# Altium schematic sheet SH1 - 48V POWER.SchDoc: =documentname
size B; Organization: UW Robotics; Address1: 200 University Avenue; Address2: Waterloo; Address3: Ontario; Address4: Canada N2L 3G6; DocumentNumber: 1; SheetNumber: 1
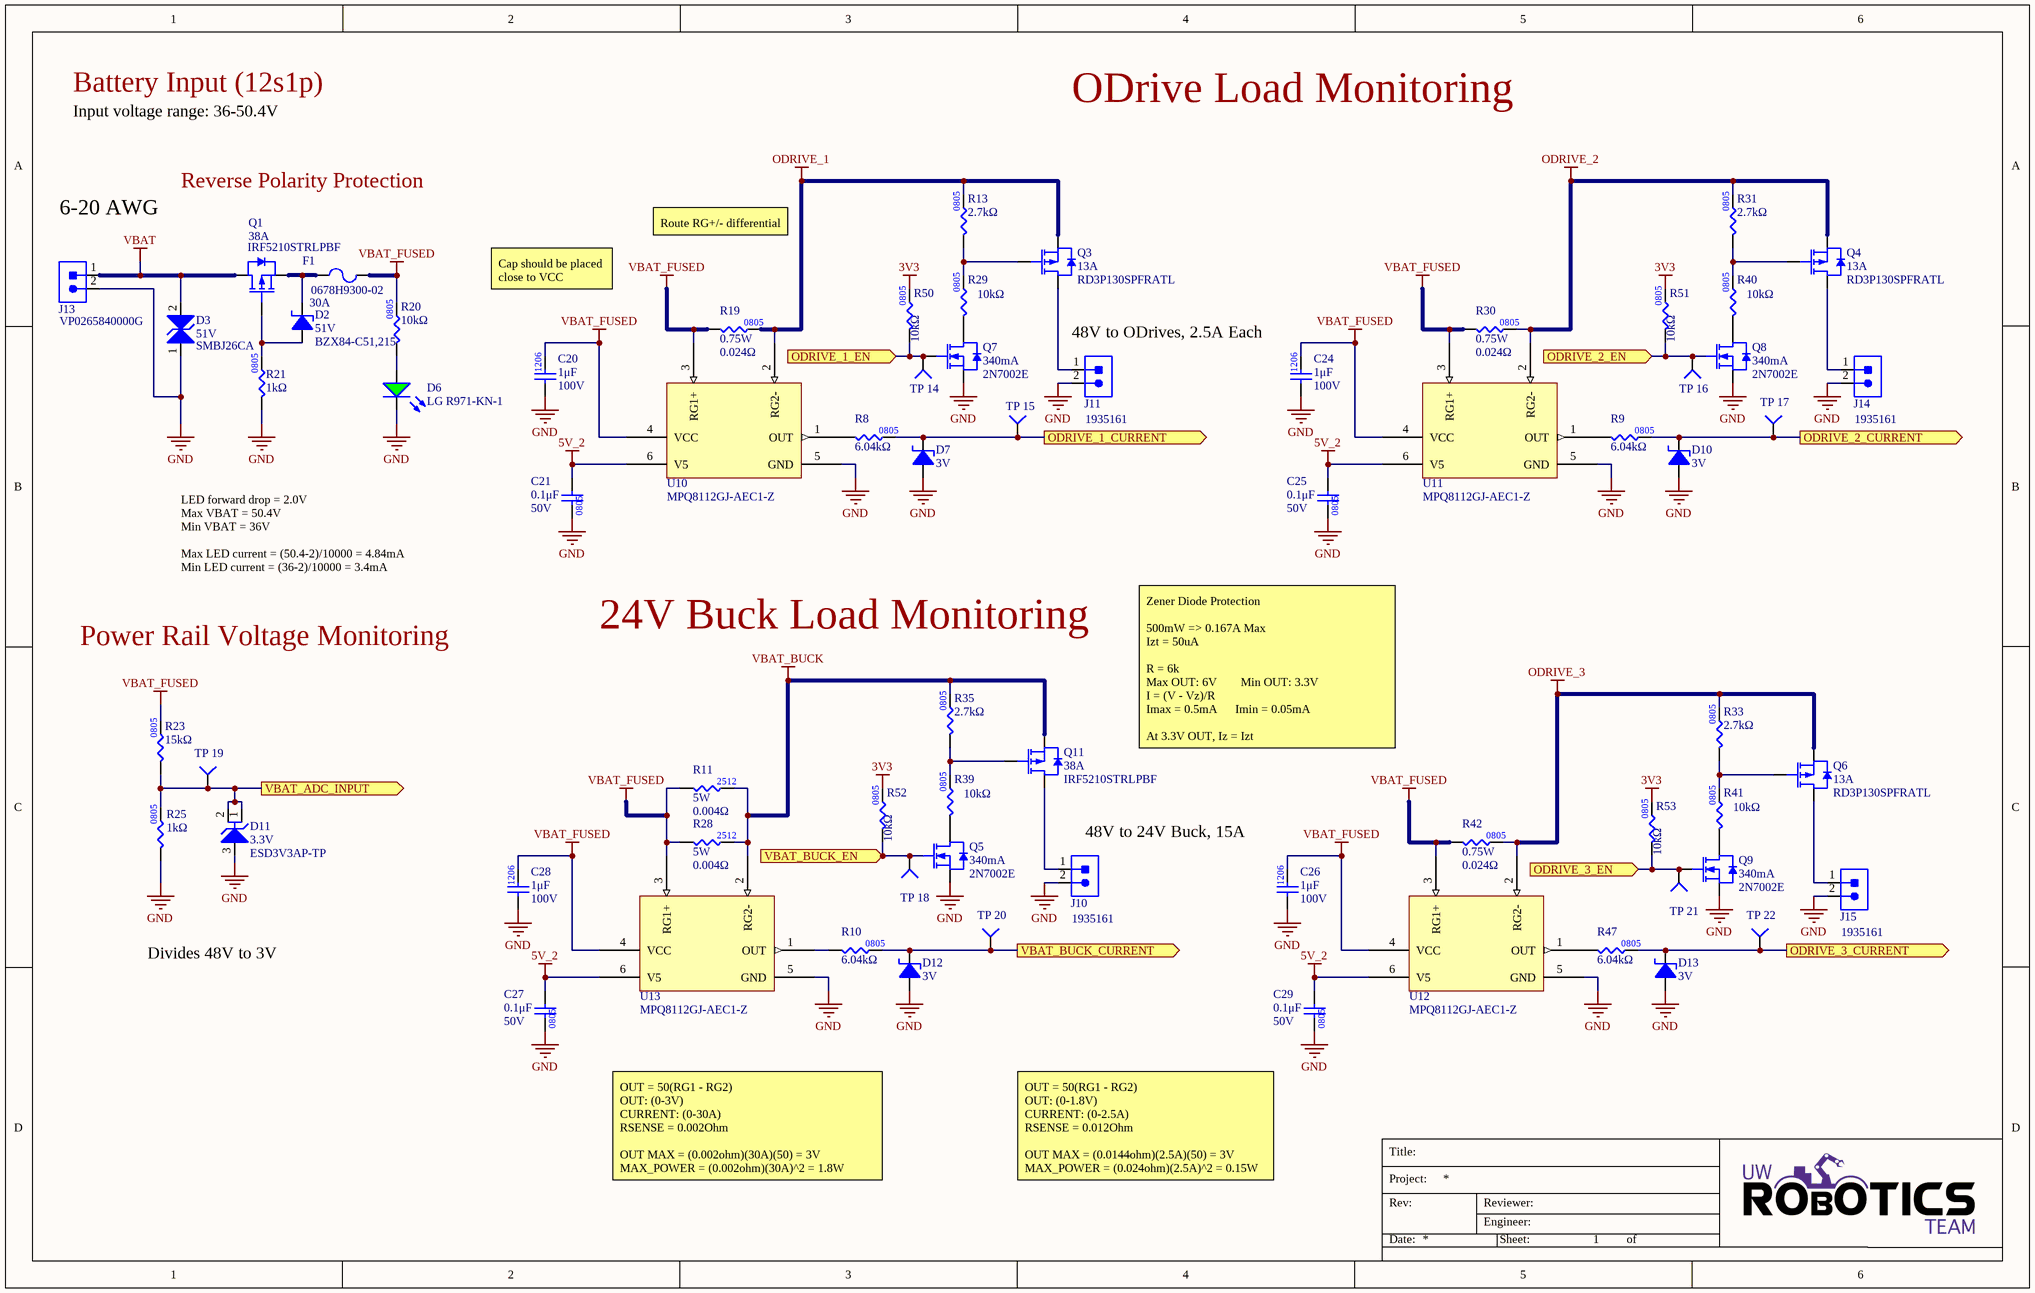
[diagram p0: SH1 - 48V POWER.SchDoc]

## Parts
C20  value 1μF  Voltage Rating: 100V  [CAPC3216X190X50NL20T25]  (hidden comment: CAP_1uF_100V_1206)
C21  value 0.1μF  Voltage Rating: 50V  [CAP2012]  (hidden comment: CAP_0.1uF_50V_0805)
C24  value 1μF  Voltage Rating: 100V  [CAPC3216X190X50NL20T25]  (hidden comment: CAP_1uF_100V_1206)
C25  value 0.1μF  Voltage Rating: 50V  [CAP2012]  (hidden comment: CAP_0.1uF_50V_0805)
C26  value 1μF  Voltage Rating: 100V  [CAPC3216X190X50NL20T25]  (hidden comment: CAP_1uF_100V_1206)
C27  value 0.1μF  Voltage Rating: 50V  [CAP2012]  (hidden comment: CAP_0.1uF_50V_0805)
C28  value 1μF  Voltage Rating: 100V  [CAPC3216X190X50NL20T25]  (hidden comment: CAP_1uF_100V_1206)
C29  value 0.1μF  Voltage Rating: 50V  [CAP2012]  (hidden comment: CAP_0.1uF_50V_0805)
D2  Manufacturer Part Number 1: BZX84-C51,215  Working Voltage: 51V  [SOT23-3]  (hidden comment: DIO_ZENER_51V)
D3  Manufacturer Part Number 1: SMBJ26CA  Voltage - Reverse Standoff (Typ): 51V  [TVS_DIODE_BIDIR_SMB]  (hidden comment: TVS_DIODE_BIDIR_51V)
D6  Manufacturer Part Number 1: LG R971-KN-1  [LED_0805_GREEN]  (hidden comment: LED_GREEN)
D7  Working Voltage: 3V  [MMSZ4683-TP]  (hidden comment: DIO_ZENER_3V)
D10  Working Voltage: 3V  [MMSZ4683-TP]  (hidden comment: DIO_ZENER_3V)
D11  Voltage - Reverse Standoff (Typ): 3.3V  [ESD3V3AP-TP]  (hidden comment: TVS_DIODE_3.3V_13.3A)
D12  Working Voltage: 3V  [MMSZ4683-TP]  (hidden comment: DIO_ZENER_3V)
D13  Working Voltage: 3V  [MMSZ4683-TP]  (hidden comment: DIO_ZENER_3V)
F1  Manufacturer Part Number 1: 0678H9300-02  Current Rating: 30A  [FUSE_3912]  (hidden comment: FUSE_30A_3912)
J10  CON_2M_TERM  [1935161]  (value not drawn)
J11  CON_2M_TERM  [1935161]  (value not drawn)
J13  CON_2POS_SCREW_TERM  [VP0265840000G]  (value not drawn)
J14  CON_2M_TERM  [1935161]  (value not drawn)
J15  CON_2M_TERM  [1935161]  (value not drawn)
Q1  Current - Continous Drain: 38A  Manufacturer Part Number 1: IRF5210STRLPBF  [DPAK254P1524X483-4_3N - new]  (hidden comment: PMOS_100V_38A)
Q3  Current - Continous Drain: 13A  [RD3P130SPFRATL]  (hidden comment: PMOS_100V_13A)
Q4  Current - Continous Drain: 13A  [RD3P130SPFRATL]  (hidden comment: PMOS_100V_13A)
Q5  Id: 340mA  Manufacturer Part Number 1: 2N7002E  [SOT23-3]  (hidden comment: NMOS_60V_340mS)
Q6  Current - Continous Drain: 13A  [RD3P130SPFRATL]  (hidden comment: PMOS_100V_13A)
Q7  Id: 340mA  Manufacturer Part Number 1: 2N7002E  [SOT23-3]  (hidden comment: NMOS_60V_340mS)
Q8  Id: 340mA  Manufacturer Part Number 1: 2N7002E  [SOT23-3]  (hidden comment: NMOS_60V_340mS)
Q9  Id: 340mA  Manufacturer Part Number 1: 2N7002E  [SOT23-3]  (hidden comment: NMOS_60V_340mS)
Q11  Current - Continous Drain: 38A  Manufacturer Part Number 1: IRF5210STRLPBF  [DPAK254P1524X483-4_3N - new]  (hidden comment: PMOS_100V_38A)
R8  value 6.04kΩ  [RES0805]  (hidden comment: RES_6.04kΩ_0805_1%)
R9  value 6.04kΩ  [RES0805]  (hidden comment: RES_6.04kΩ_0805_1%)
R10  value 6.04kΩ  [RES0805]  (hidden comment: RES_6.04kΩ_0805_1%)
R11  value 0.004Ω  Power: 5W  [RESC6532X75N]  (hidden comment: RES_4mΩ_2512_1%_5W)
R13  value 2.7kΩ  [RES0805]  (hidden comment: RES_2.7kΩ_0805_1%)
R19  value 0.024Ω  Power: 0.75W  [RES0805]  (hidden comment: RES_24mΩ_0805_1%)
R20  value 10kΩ  [RES0805]  (hidden comment: RES_10kΩ_0805_5%)
R21  value 1kΩ  [RES0805]  (hidden comment: RES_1kΩ_0805_1%)
R23  value 15kΩ  [RES0805]  (hidden comment: RES_15kΩ_0805_1%)
R25  value 1kΩ  [RES0805]  (hidden comment: RES_1kΩ_0805_1%_1)
R28  value 0.004Ω  Power: 5W  [RESC6532X75N]  (hidden comment: RES_4mΩ_2512_1%_5W)
R29  value 10kΩ  [RES0805]  (hidden comment: RES_10kΩ_0805_5%)
R30  value 0.024Ω  Power: 0.75W  [RES0805]  (hidden comment: RES_24mΩ_0805_1%)
R31  value 2.7kΩ  [RES0805]  (hidden comment: RES_2.7kΩ_0805_1%)
R33  value 2.7kΩ  [RES0805]  (hidden comment: RES_2.7kΩ_0805_1%)
R35  value 2.7kΩ  [RES0805]  (hidden comment: RES_2.7kΩ_0805_1%)
R39  value 10kΩ  [RES0805]  (hidden comment: RES_10kΩ_0805_5%)
R40  value 10kΩ  [RES0805]  (hidden comment: RES_10kΩ_0805_5%)
R41  value 10kΩ  [RES0805]  (hidden comment: RES_10kΩ_0805_5%)
R42  value 0.024Ω  Power: 0.75W  [RES0805]  (hidden comment: RES_24mΩ_0805_1%)
R47  value 6.04kΩ  [RES0805]  (hidden comment: RES_6.04kΩ_0805_1%)
R50  value 10kΩ  [RES0805]  (hidden comment: RES_10kΩ_0805_5%)
R51  value 10kΩ  [RES0805]  (hidden comment: RES_10kΩ_0805_5%)
R52  value 10kΩ  [RES0805]  (hidden comment: RES_10kΩ_0805_5%)
R53  value 10kΩ  [RES0805]  (hidden comment: RES_10kΩ_0805_5%)
TP_14  TESTPOINT_1MM_CIRCLE  [TESTPOINT_CIRCLE_1MM]  (value not drawn)  (no BOM)
TP_15  TESTPOINT_1MM_CIRCLE  [TESTPOINT_CIRCLE_1MM]  (value not drawn)  (no BOM)
TP_16  TESTPOINT_1MM_CIRCLE  [TESTPOINT_CIRCLE_1MM]  (value not drawn)  (no BOM)
TP_17  TESTPOINT_1MM_CIRCLE  [TESTPOINT_CIRCLE_1MM]  (value not drawn)  (no BOM)
TP_18  TESTPOINT_1MM_CIRCLE  [TESTPOINT_CIRCLE_1MM]  (value not drawn)  (no BOM)
TP_19  TESTPOINT_1MM_CIRCLE  [TESTPOINT_CIRCLE_1MM]  (value not drawn)  (no BOM)
TP_20  TESTPOINT_1MM_CIRCLE  [TESTPOINT_CIRCLE_1MM]  (value not drawn)  (no BOM)
TP_21  TESTPOINT_1MM_CIRCLE  [TESTPOINT_CIRCLE_1MM]  (value not drawn)  (no BOM)
TP_22  TESTPOINT_1MM_CIRCLE  [TESTPOINT_CIRCLE_1MM]  (value not drawn)  (no BOM)
U10  MPQ8112GJ-AEC1-Z  [MPQ8112GJ-AEC1-Z]
U11  MPQ8112GJ-AEC1-Z  [MPQ8112GJ-AEC1-Z]
U12  MPQ8112GJ-AEC1-Z  [MPQ8112GJ-AEC1-Z]
U13  MPQ8112GJ-AEC1-Z  [MPQ8112GJ-AEC1-Z]

## Ports
ODRIVE_1_CURRENT (out), ODRIVE_1_EN (in), ODRIVE_2_CURRENT (out), ODRIVE_2_EN (in), ODRIVE_3_CURRENT (out), ODRIVE_3_EN (in), VBAT_ADC_INPUT (out), VBAT_BUCK_CURRENT (out), VBAT_BUCK_EN (in)

## Nets
3V3: R50.2 R51.2 R52.2 R53.2
5V_2: C21.2 C25.2 C27.2 C29.2 U10.6(V5) U11.6(V5) U12.6(V5) U13.6(V5)
GND: C20.1 C21.1 C24.1 C25.1 C26.1 C27.1 C28.1 C29.1 D3.1 D6.2(K) D7.1(Anode) D10.1(Anode) D11.3 D12.1(Anode) D13.1(Anode) J10.2 J11.2 J13.2 J14.2 J15.2 Q5.2(Source) Q7.2(Source) Q8.2(Source) Q9.2(Source) R21.1 R25.1 U10.5(GND) U11.5(GND) U12.5(GND) U13.5(GND)
ODRIVE_1: Q3.3(Source) R13.2 R19.2 U10.2(RG2-)
ODRIVE_2: Q4.3(Source) R30.2 R31.2 U11.2(RG2-)
ODRIVE_3: Q6.3(Source) R33.2 R42.2 U12.2(RG2-)
VBAT: D3.2 J13.1 Q1.2(Drain)
VBAT_BUCK: Q11.3(Source) R11.2 R28.2 R35.2 U13.2(RG2-)
VBAT_FUSED: C20.2 C24.2 C26.2 C28.2 F1.2 R11.1 R19.1 R20.2 R23.2 R28.1 R30.1 R42.1 U10.3(RG1+) U10.4(VCC) U11.3(RG1+) U11.4(VCC) U12.3(RG1+) U12.4(VCC) U13.3(RG1+) U13.4(VCC)
ODRIVE_1_CURRENT: D7.2(Cathode) R8.2 TP_15.1(=value) ; port ODRIVE_1_CURRENT
ODRIVE_1_EN: Q7.1(Gate) R50.1 TP_14.1(=value) ; port ODRIVE_1_EN
ODRIVE_2_CURRENT: D10.2(Cathode) R9.2 TP_17.1(=value) ; port ODRIVE_2_CURRENT
ODRIVE_2_EN: Q8.1(Gate) R51.1 TP_16.1(=value) ; port ODRIVE_2_EN
ODRIVE_3_CURRENT: D13.2(Cathode) R47.2 TP_22.1(=value) ; port ODRIVE_3_CURRENT
ODRIVE_3_EN: Q9.1(Gate) R53.1 TP_21.1(=value) ; port ODRIVE_3_EN
VBAT_ADC_INPUT: D11.1 D11.2 R23.1 R25.2 TP_19.1(=value) ; port VBAT_ADC_INPUT
VBAT_BUCK_CURRENT: D12.2(Cathode) R10.2 TP_20.1(=value) ; port VBAT_BUCK_CURRENT
VBAT_BUCK_EN: Q5.1(Gate) R52.1 TP_18.1(=value) ; port VBAT_BUCK_EN
NetD2_1: D2.1(Anode) Q1.1(Gate) R21.2
NetD2_3: D2.3(Cathode) F1.1 Q1.3(Source)
NetD6_1: D6.1(A) R20.1
NetJ10_1: J10.1 Q11.2(Drain)
NetJ11_1: J11.1 Q3.2(Drain)
NetJ14_1: J14.1 Q4.2(Drain)
NetJ15_1: J15.1 Q6.2(Drain)
NetQ3_1: Q3.1(Gate) R13.1 R29.2
NetQ4_1: Q4.1(Gate) R31.1 R40.2
NetQ5_3: Q5.3(Drain) R39.1
NetQ6_1: Q6.1(Gate) R33.1 R41.2
NetQ7_3: Q7.3(Drain) R29.1
NetQ8_3: Q8.3(Drain) R40.1
NetQ9_3: Q9.3(Drain) R41.1
NetQ11_1: Q11.1(Gate) R35.1 R39.2
NetR8_1: R8.1 U10.1(OUT)
NetR9_1: R9.1 U11.1(OUT)
NetR10_1: R10.1 U13.1(OUT)
NetR47_1: R47.1 U12.1(OUT)

## Notes on the sheet
- Battery Input (12s1p)
- Input voltage range: 36-50.4V
- ODrive Load Monitoring
- 6-20 AWG
- Reverse Polarity Protection
- Route RG+/- differential
- Cap should be placed close to VCC
- 48V to ODrives, 2.5A Each
- LED forward drop = 2.0V
  Max VBAT = 50.4V
  Min VBAT = 36V
  Max LED current = (50.4-2)/10000 = 4.84mA
  Min LED current = (36-2)/10000 = 3.4mA
- 24V Buck Load Monitoring
- Power Rail Voltage Monitoring
- Zener Diode Protection
  500mW => 0.167A Max
  Izt = 50uA
  R = 6k
  Max OUT: 6V        Min OUT: 3.3V
  I = (V - Vz)/R
  Imax = 0.5mA      Imin = 0.05mA
  At 3.3V OUT, Iz = Izt
- 48V to 24V Buck, 15A
- Divides 48V to 3V
- OUT = 50(RG1 - RG2)
  OUT: (0-3V)
  CURRENT: (0-30A)
  RSENSE = 0.002Ohm
  OUT MAX = (0.002ohm)(30A)(50) = 3V
  MAX_POWER = (0.002ohm)(30A)^2 = 1.8W
- OUT = 50(RG1 - RG2)
  OUT: (0-1.8V)
  CURRENT: (0-2.5A)
  RSENSE = 0.012Ohm
  OUT MAX = (0.0144ohm)(2.5A)(50) = 3V
  MAX_POWER = (0.024ohm)(2.5A)^2 = 0.15W
- Title:
- Project:
- Date:
- Rev:
- Reviewer:
- Engineer:
- Sheet:
- of
- (in symbol RES_4mΩ_2512_1%_5W) 2512
- (in symbol RES_15kΩ_0805_1%) 0805

## Library data of the parts
C20 C24 C26 C28 = CAP_1uF_100V_1206: CAP CER 1UF 100V X7R 1206; Supplier 1: Digi-Key; Mounting Type: SMD; Package: 1206; Supplier Part Number 1: 490-16468-1-ND
C21 C25 C27 C29 = CAP_0.1uF_50V_0805: CAP CER 0.1UF 50V X7R 0805; Manufacturer Part Number 1: GCM21BR71H104KA37K; Manufacturer 1: Murata Electronics; Package/Footprint: 0805; Supplier Part Number 1: 490-8049-1-ND; Supplier 1: Digi-Key; Dielectric: X7R; LCSC Part #: C49678; Mounting Type: SMD
D2 = DIO_ZENER_51V: DIODE ZENER 51V 250MW TO236AB; Manufacturer 1: Nexperia USA Inc.; Forward Voltage: 0.9V; Supplier Part Number 1: 1727-5037-1-ND; Supplier 1: Digi-Key; Package/Case: SOT-23-3
D3 = TVS_DIODE_BIDIR_51V: TVS DIODE 51VWM 82.4VC DO214AA; Manufacturer 1: Littelfuse; Package/Footprint: SMB; Voltage - Clamping (Max) @ Ipp: 82.4V; Voltage - Breakdown (Min): 56.7V; Mounting Type: SMD; Supplier 1: Digi-Key; Supplier Part Number 1: SMBJ51CALFCT-ND; Supplier 2: Digi-Key; Supplier Part Number 2: SMBJ51CA-FDIDKR-ND
D6 = LED_GREEN: LED GREEN DIFFUSED 0805 SMD; Manufacturer 1: OSRAM; Forward Voltage Drop: 2.2V; Package/Footprint: 0805; Mounting Type: SMD; Supplier 1: Digi-Key; Supplier Part Number 1: 475-1410-1-ND; Supplier 2: Future Electronics; Supplier Part Number 2: 1152237
D7 D10 D12 D13 = DIO_ZENER_3V: DIODE ZENER 3V 500MW SOD123; Manufacturer 1: Micro Commercial Co; Forward Voltage: 0.95V; Manufacturer Part Number 1: MMSZ4683-TP; Supplier Part Number 1: MMSZ4683-TPMSCT-ND; Supplier 1: Digi-Key; Package/Case: SOD-123
D11 = TVS_DIODE_3.3V_13.3A: TVS DIODE 3.3VWM 7.5VC SOT23; Manufacturer 1: Micro Commercial Co; Package/Footprint: SOT-23; Voltage - Breakdown (Min): 5V; Voltage - Clamping (Max) @ Ipp: 7.5V; Mounting Type: SMD; Supplier 1: Digi-Key; Supplier Part Number 1: ESD3V3AP-TPMSCT-ND; Manufacturer Part Number 1: ESD3V3AP-TP
F1 = FUSE_30A_3912: FUSE SMT 3912 ENH BRK 250V 30A; Manufacturer 1: Bel Fuse Inc.; Package/Footprint: 3912; Supplier 1: Digi-Key; Supplier Part Number 1: 507-2254-1-ND; Mounting Type: SMD; Verified: No
J10 J11 J14 J15 = CON_2M_TERM: TERM BLK 2POS SIDE ENTRY 5MM; Manufacturer 1: Phoenix Contact; Max Current Rating: 16A; Current: 18A; Voltage: 300V; Package/Footprint: SMD; Supplier 1: Digi-Key; Supplier Part Number 1: 277-1667-ND; Manufacturer Part Number 1: 1935161; Mounting Type: TH
J13 = CON_2POS_SCREW_TERM_65A: PCB TERMINAL BLOCKS RISING CLAMP; Manufacturer 1: Amphenol Anytek; Supplier 1: Digi-Key; Mounting Type: TH; Package/Footprint: TERMINAL; Supplier Part Number 1: 1818-VP0265840000G-ND; Manufacturer Part Number 1: VP0265840000G
Q1 Q11 = PMOS_100V_38A: MOSFET P-CH 100V 38A D2PAK; Manufacturer 1: Vishay Siliconix; Vgs (Max): ±15V; Id: 120A; Mounting Type: SMD; Verified: No; Vdss: 100V; Supplier 1: Digi-Key; Supplier Part Number 1: IRF5210STRLPBFCT-ND; Package/Footprint: D2Pak
Q3 Q4 Q6 = PMOS_100V_13A: MOSFET P-CH 100V 13A TO252; Manufacturer 1: Rohm Semiconductor; Vgs (Max): ±20V; Package/Footprint: D2Pak; Mounting Type: SMD; Verified: No; Vdss: 100V; Supplier 1: Digi-Key; Supplier Part Number 1: RD3P130SPFRATLCT-ND; Manufacturer Part Number 1: RD3P130SPFRATL
Q5 Q7-Q9 = NMOS_60V_340mS: N-Channel 60 V 340mA (Ta) 350mW (Ta) Surface Mount SOT-23; Manufacturer 1: ANBON SEMICONDUCTOR (INT'L) LIMITED; Vgs (Max): ±20V; Vdss: 60V; Supplier 1: Digi-Key; Supplier Part Number 1: 4530-2N7002ECT-ND; Mounting Type: SMD; Package/Footprint: SOT-23; Verified: No
R8-R10 R47 = RES_6.04kΩ_0805_1%: RES 6.04K OHM 1% 1/8W 0805; Manufacturer 1: Yageo; Manufacturer Part Number 1: RC0805FR-076K04L; Package/Footprint: 0805; Mounting Type: SMD; Supplier 1: Digi-Key; Supplier Part Number 1: 311-6.04KCRCT-ND
R11 R28 = RES_4mΩ_2512_1%_5W: RES 4M OHM 1% 5W 2512; Manufacturer 1: KOA Speer Electronics, Inc.; Manufacturer Part Number 1: TLR3APDTE4L00F75; Supplier 1: Digi-Key; Supplier Part Number 1: 2019-TLR3APDTE4L00F75CT-ND
R13 R31 R33 R35 = RES_2.7kΩ_0805_1%: RES 2.7K OHM 1% 1/8W 0805; Manufacturer 1: Panasonic Electronic Components; Manufacturer Part Number 1: ERJ-6ENF2701V; Supplier 1: Digi-Key; Supplier Part Number 1: P2.70KCCT-ND; Mounting Type: SMD; LCSC Part #: C17530; Package: 0805
R19 R30 R42 = RES_24mΩ_0805_1%: RES 0.024 OHM 1% 3/4W 0805; Manufacturer 1: Thin Film Technology Corp.; Manufacturer Part Number 1: D1WEL0805MR024F-T5; Supplier 1: Digi-Key; Supplier Part Number 1: 4463-D1WEL0805MR024F-T5CT-ND; Package: 0805
R20 R29 R39-R41 R50-R53 = RES_10kΩ_0805_5%: RES 10K OHM 5% 1/8W 0805; Manufacturer 1: Panasonic Electronic Components; Manufacturer Part Number 1: ERJ-6GEYJ103V; Package/Footprint: 0805; Supplier Part Number 1: P10KACT-ND; Supplier 1: Digi-Key; LCSC Part #: C17414; Mounting Type: SMD
R21 = RES_1kΩ_0805_1%: RES 1K OHM 1% 1/8W 0805; Manufacturer 1: Yageo; Manufacturer Part Number 1: RC0805FR-071KL; Package: 0805; Supplier Part Number 1: 311-1.00KCRCT-ND; Supplier 1: Digi-Key; Mounting Type: SMD; LCSC Part #: C17513
R23 = RES_15kΩ_0805_1%: RES 15K OHM 1% 1/8W 0805 /; Manufacturer 1: Vishay Dale; Manufacturer Part Number 1: CRCW080515K0FKEA; Supplier Part Number 1: 541-15.0KCCT-ND; Supplier 1: Digi-Key
R25 = RES_1kΩ_0805_1%_1: RES 1K OHM 1% 1/8W 0805; Manufacturer 1: Yageo; Manufacturer Part Number 1: RC0805FR-071KL; Supplier 1: Digi-Key; Supplier Part Number 1: 311-1.00KCRCT-ND; Package: 0805; Mounting Type: SMD; LCSC Part #: C17513
TP_14-TP_22 = TESTPOINT_1MM_CIRCLE: TESTPOINT 1MM CIRCLE
U10-U13 = MPQ8112GJ-AEC1-Z: 60V, HIGH-SIDE CURRENT-SENSE AMP; Manufacturer: Monolithic Power Systems Inc.; Vmin: 2.7V; Gain: 50; Supplier: Digi-Key; Supplier Part Number: 1589-MPQ8112GJ-AEC1-ZCT-ND; Vmax: 60V; Supplier 1: Digi-Key; Supplier Part Number 1: 1589-MPQ8112GJ-AEC1-ZCT-ND; Manufacturer Part Number: MPQ8112GJ-AEC1-Z